# EAGLE design bGeigieNanoKit (EAGLE 6.4)
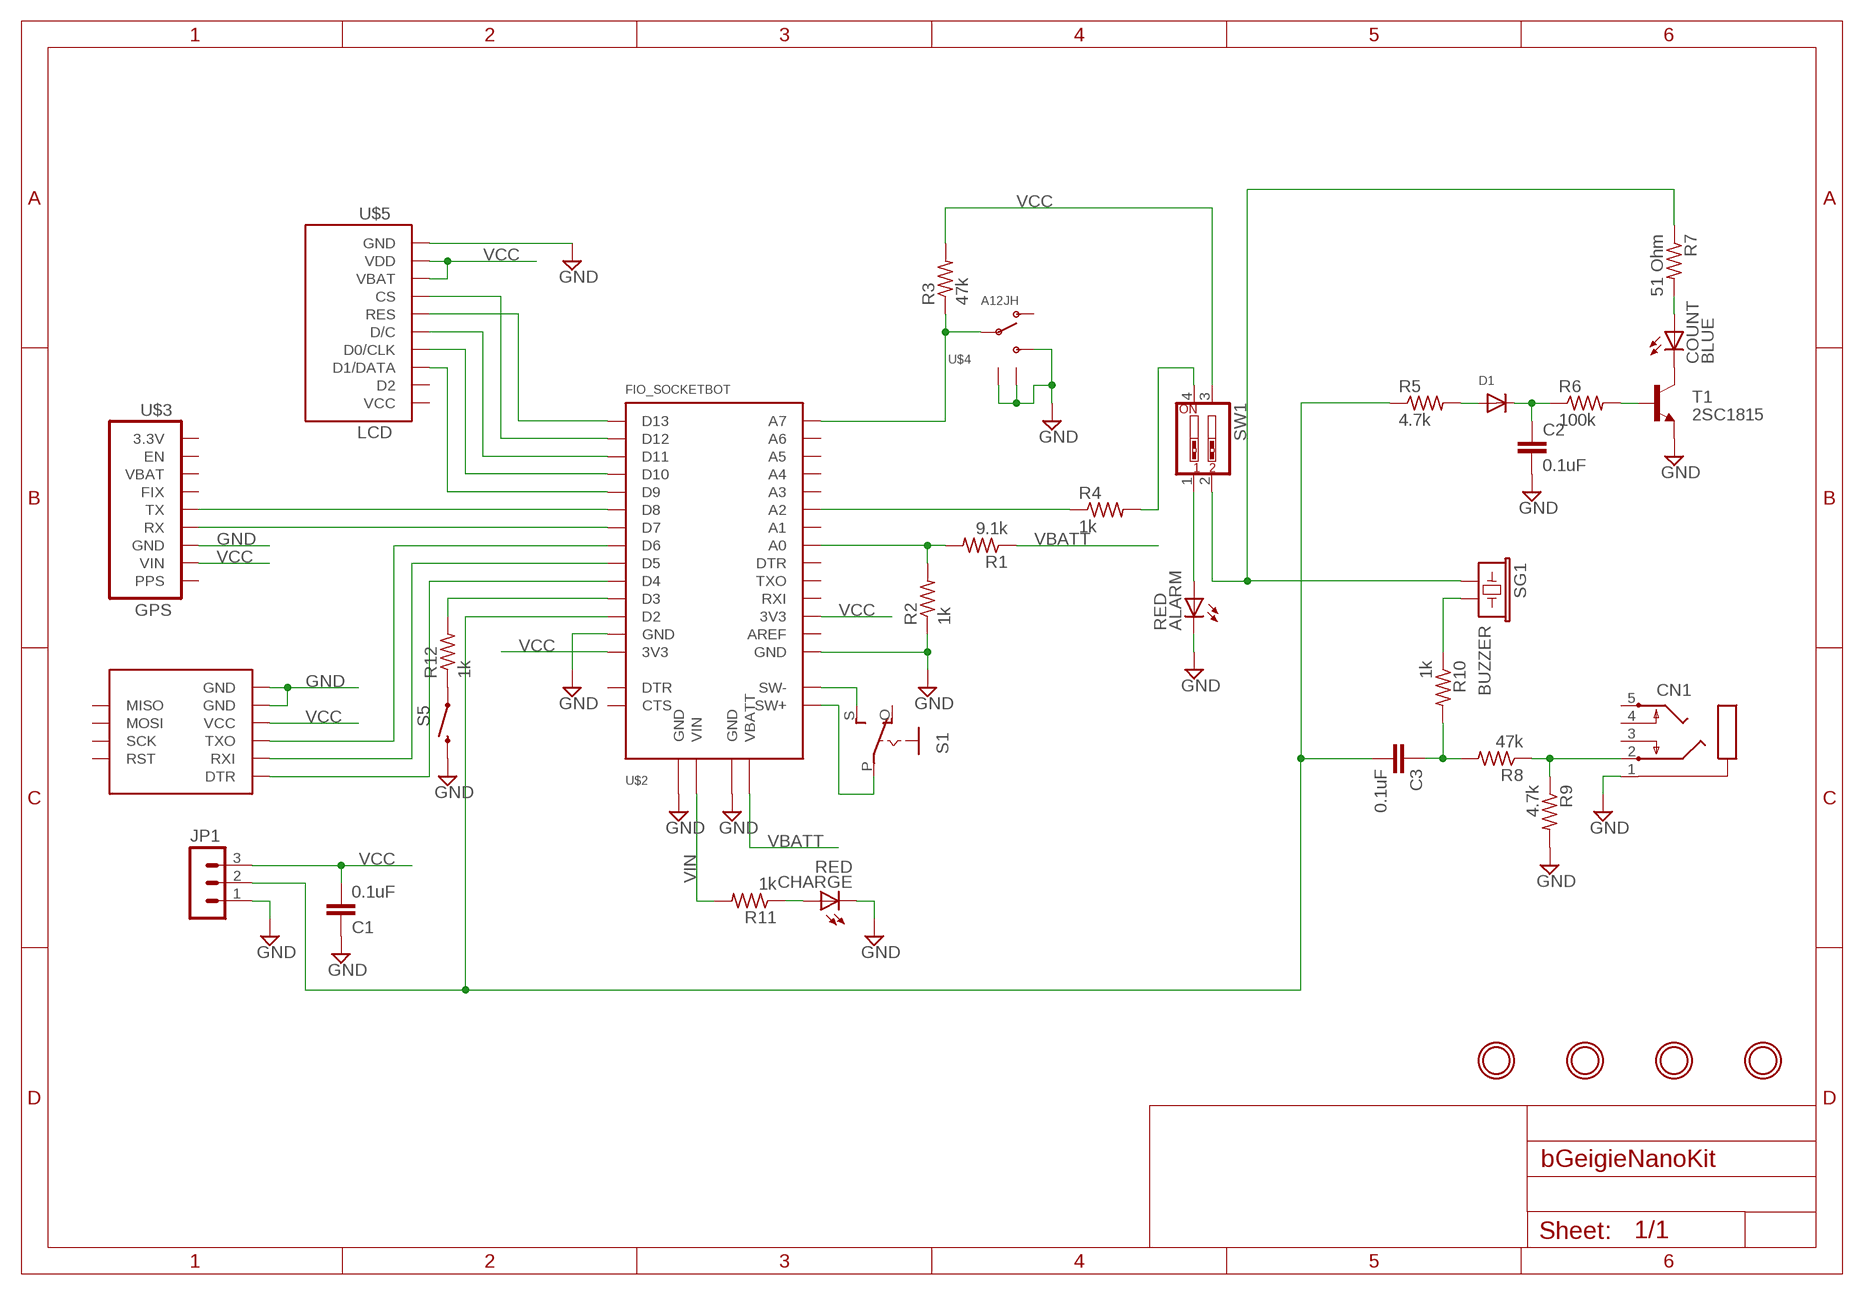
[diagram p0: schematic, sheet 1]

## Parts
ALARM  RED  LED3MM  [LED3MM]
C1  0.1uF  C-EU050-024X044  [C050-024X044]
C2  0.1uF  C-EU050-024X044  [C050-024X044]
C3  0.1uF  C-EU050-024X044  [C050-024X044]
CHARGE  RED  LED3MM  [LED3MM]
CN1  AUDIO_STEREOJACK  [STX3100]
COUNT  BLUE  LED3MM  [LED3MM]
D1  DIODEDO-1N4148  [DO-1N4148]
JP1  MA03-1  [MA03-1]
R1  9.1k  R-US_0207/10  [0207/10]
R2  1k  R-US_0207/10  [0207/10]
R3  47k  R-US_0207/10  [0207/10]
R4  1k  R-US_0207/10  [0207/10]
R5  4.7k  R-US_0207/10  [0207/10]
R6  100k  R-US_0207/10  [0207/10]
R7  51 Ohm  R-US_0207/10  [0207/10]
R8  47k  R-US_0207/10  [0207/10]
R9  4.7k  R-US_0207/10  [0207/10]
R10  1k  R-US_0207/10  [0207/10]
R11  1k  R-US_0207/10  [0207/10]
R12  1k  R-US_0207/10  [0207/10]
S1  EG1218S  [EG1218]
S5  SWITCH-MOMENTARY-2PTH  [TACTILE-PTH]
SG1  BUZZER  BUZZERPTH  [BUZZER-12MM]
SW1  SW_DIP-2  [EDG-02]
T1  2SC1815  [TO92-ECB]
U$1  OPENLOG  [OPENLOG]
U$2  FIO_SOCKETBOT  [FIO_V23_SOCKET_BOT]
U$3  GPS  ULTIMATE_GPSTOP  [ULTIMATE_GPS_V3_TOP]
U$4  A12JH  [A12AH]
U$5  LCD  SSD1306_128X64_LCD_MIN  [SSD1306_128X64_LCD_MIN]
U$6  MOUNTINGHOLE3.0THIN  [MOUNTINGHOLE_3.0_PLATEDTHIN]
U$7  MOUNTINGHOLE3.0THIN  [MOUNTINGHOLE_3.0_PLATEDTHIN]
U$8  MOUNTINGHOLE3.0THIN  [MOUNTINGHOLE_3.0_PLATEDTHIN]
U$9  MOUNTINGHOLE3.0THIN  [MOUNTINGHOLE_3.0_PLATEDTHIN]

## Nets
GND [PWP]: ALARM.K(C) C1.1 C2.2 CHARGE.K(C) CN1.1 JP1.1 R2.1 R9.2 S5.3 T1.E U$1.JP1$5(GND) U$1.JP1$6(GND) U$2.JP1$2(GND) U$2.JP2$1(GND) U$2.JP5$1(GND) U$2.JP6$1(GND) U$3.JP1$3(GND) U$3.U$8$P$1(GND) U$3.U$9$P$1(GND) U$4.P$3 U$4.P$4(GND) U$4.P$5(GND) U$5.P0\$10(GND)
N$1: U$2.JP1$10(D9) U$5.P0\$3(D1/DATA)
N$2: U$2.JP1$11(D10) U$5.P0\$4(D0/CLK)
N$3: U$2.JP1$12(D11) U$5.P0\$5(D/C)
N$4: U$2.JP1$13(D12) U$5.P0\$7(CS)
N$5: U$2.JP1$14(D13) U$5.P0\$6(RES)
N$6: U$2.JP1$9(D8) U$3.JP1$5(TX)
N$7: U$2.JP1$8(D7) U$3.JP1$4(RX)
N$8: U$1.JP1$3(TXO) U$2.JP1$7(D6)
N$9: U$1.JP1$2(RXI) U$2.JP1$6(D5)
N$10: U$1.JP1$1(DTR) U$2.JP1$5(D4)
N$11: R1.2 R2.2 U$2.JP5$7(A0)
N$12 [HIGH_PWR]: S1.P U$2.JP7$2(SW+)
N$13 [HIGH_PWR]: S1.S U$2.JP7$1(SW-)
N$14: R3.1 U$2.JP5$14(A7) U$4.P$2
N$15: R4.1 U$2.JP5$9(A2)
N$16: ALARM.A SW1.1
N$17: R4.2 SW1.4
N$18: C3.2 JP1.2 R5.1 U$2.JP1$3(D2)
N$19: COUNT.A R7.2
N$20: R12.1 S5.1
N$21: R7.1 SG1.+ SW1.2
N$22: COUNT.K(C) T1.C
N$23: R10.1 SG1.-
N$24: C3.1 R8.2 R10.2
N$25: CN1.2 R8.1 R9.1
N$26: D1.A R5.2
N$27: C2.1 D1.C R6.1
N$28: R6.2 T1.B
N$29: CHARGE.A R11.1
N$30: R12.2 U$2.JP1$4(D3)
VBATT: R1.1 U$2.JP2$2(VBATT)
VCC [PWP]: C1.2 JP1.3 R3.2 SW1.3 U$1.JP1$4(VCC) U$2.JP1$1(3V3) U$2.JP5$3(3V3) U$3.JP1$2(VIN) U$5.P0\$8(VBAT) U$5.P0\$9(VDD)
VIN: R11.2 U$2.JP6$2(VIN)
Unconnected: CN1.3 CN1.4 CN1.5 S1.O U$1.JP2$1(RST) U$1.JP2$2(SCK) U$1.JP2$3(MOSI) U$1.JP2$4(MISO) U$2.JP5$2(AREF) U$2.JP5$4(RXI) U$2.JP5$5(TXO) U$2.JP5$6(DTR) U$2.JP5$8(A1) U$2.JP5$10(A3) U$2.JP5$11(A4) U$2.JP5$12(A5) U$2.JP5$13(A6) U$2.JP8$1(CTS) U$2.JP9$1(DTR) U$3.JP1$1(PPS) U$3.JP1$6(FIX) U$3.JP1$8(EN) U$3.JP1$9(3.3V) U$4.P$1 U$5.P0\$2(D2)

## Power pins joined to a net without a drawn wire
VBAT: U$3.JP1$7(VBAT)
VCC: U$5.P0\$1(VCC)

## Library data of the parts
ALARM CHARGE COUNT = adafruit:LED: LED OSRAM: - CHIPLED LG R971, LG N971, LY N971, LG Q971, LY Q971, LO R971, LY R971 LH N974, LH R974 LS Q976, LO Q976, LY Q976 LO Q996 - Hyper CHIPLED LW Q18S LB Q993, LB Q99A, LB R99A - SideLED LS A670, LO A670, LY A670, LG A670, LP A670 LB A673, LV A673, LT A673, LW A673 LH A674 LY A675 LS A676, LA A676, LO A676, LY A676, LW A676 LS A679, LY A679, LG A679 - Hyper Micro SIDELED® LS Y876, LA Y876, LO Y876, LY Y876 LT Y87S - SmartLED LW L88C, LW L88S LB L89C, LB L89S, LG L890 LS L89K, LO L89K, LY L89K LS L896, LA L896, LO L896, LY L896 - TOPLED LS T670, LO T670, LY T670, LG T670, LP T670 LSG T670, LSP T670, LSY T670, LOP T670, LYG T670 LG T671, LOG T671, LSG T671 LB T673, LV T673, LT T673, LW T673 LH T674 LS T676, LA T676, LO T676, LY T676, LB T676, LH T676, LSB T676, LW T676 LB T67C, LV T67C, LT T67C, LS T67K, LO T67K, LY T67K, LW E67C LS E67B, LA E67B, LO E67B, LY E67B, LB E67C, LV E67C, LT E67C LW T67C LS T679, LY T679, LG T679 LS T770, LO T770, LY T770, LG T770, LP T770 LB T773, LV T773, LT T773, LW T773 LH T774 LS E675, LA E675, LY E675, LS T675 LS T776, LA T776, LO T776, LY T776, LB T776 LHGB T686 LT T68C, LB T68C - Hyper Mini TOPLED® LB M676 - Mini TOPLED Santana® LG M470 LS M47K, LO M47K, LY M47K Source: http://www.osram.convergy.de/
C1-C3 = rcl:C-EU: CAPACITOR, European symbol
CN1 = microbuilder:AUDIO_STEREOJACK: MIC/HEADPHONE JACK Stereo jack with two switches. Kycon STX3100, CUI SJ1-3555NG and/or 4UCon 05544 Digikey: CP1-3555NG-ND Shamelessly taken from the Adafruit Eagle library (public domain) ... thanks! These are normally connected as follows, from right-to-left on the schematic symbol above: Tip: Left Audio Inner Ring: Right Audio Shell: Common/GND
D1 = adafruit:DIODE: Diode SMADIODE - SMA Surface Mount Package 20V 1A Schottky Diode Digikey: 641-1014-6-ND DO-1N4148 - Through Hole Small Current Diode SOD-123 20V 1 A (.5mV Vf) Schottky Diode - Digikey: MBRX120TPMSCT-ND SOD-323 10V 570mA (.38mV Vf, 3ns) Schottky Diode - Digikey: ZLLS410CT-ND SOD-523 30V 30mA Schottky Diode (RB751S-40TE61) - Digikey: RB751S-40TE61CT-ND SOT23-R/W - SOT23 Package (R = Solder Paste/Reflow Ovens, W = Hand-Soldering) BAT54Film 40V 300mA - Digikey: 497-7162-1-ND
JP1 = con-lstb:MA03-1: PIN HEADER; OC_FARNELL: unknown; OC_NEWARK: unknown
R1-R12 = rcl:R-US_: RESISTOR, American symbol
S1 = adafruit:EG1218: SLIDING SWITCH 0.1" spacing through hole, vertical SPDT slide switch http://www.ladyada.net/library/pcb/eaglelibrary.html
S5 = SparkFun:SWITCH-MOMENTARY-2
SG1 = SparkFun:BUZZER: Buzzer 12mm Spark Fun Electronics SKU : Comp-Buzzer
SW1 = special:SW_DIP-2: DIP SWITCH
T1 = transistor:2SC1815: NPN EPITAXIAL TRANSISTOR Source: TOSHIBA .. 2SC1815 1.pdf
U$1 = open_hw_sockets:OPENLOG
U$2 = open_hw_sockets:FIO_SOCKET
U$3 = open_hw_sockets:ULTIMATE_GPS
U$4 = open_hw_sockets:A12JH
U$5 = open_hw_sockets:SSD1306_128X64_LCD_MIN
U$6-U$9 = microbuilder:MOUNTINGHOLE: Mounting Hole For #2 screws (0.086"/2.18mm width, 0.094"/2.4mm hole) use 2.5mm

## Net classes
0 default: width 0.406 mm, drill 0.254 mm, clearance 0.305 mm
1 PWP: width 0.813 mm, drill 0.254 mm, clearance 0.305 mm
2 HIGH_PWR: width 1.422 mm, drill 0.508 mm, clearance 0.406 mm

## Board
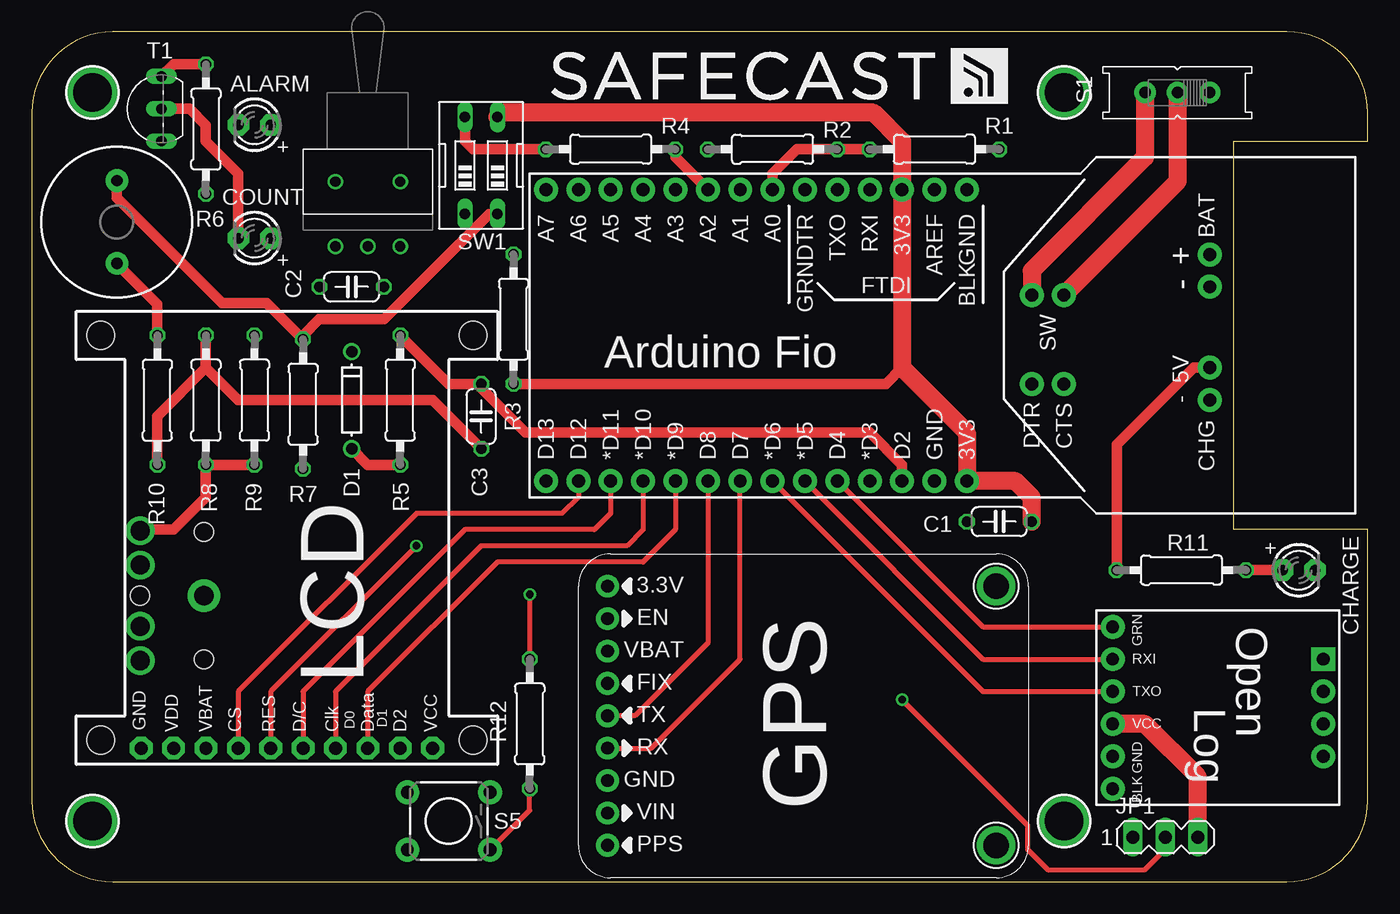
[diagram p1: board, top side]
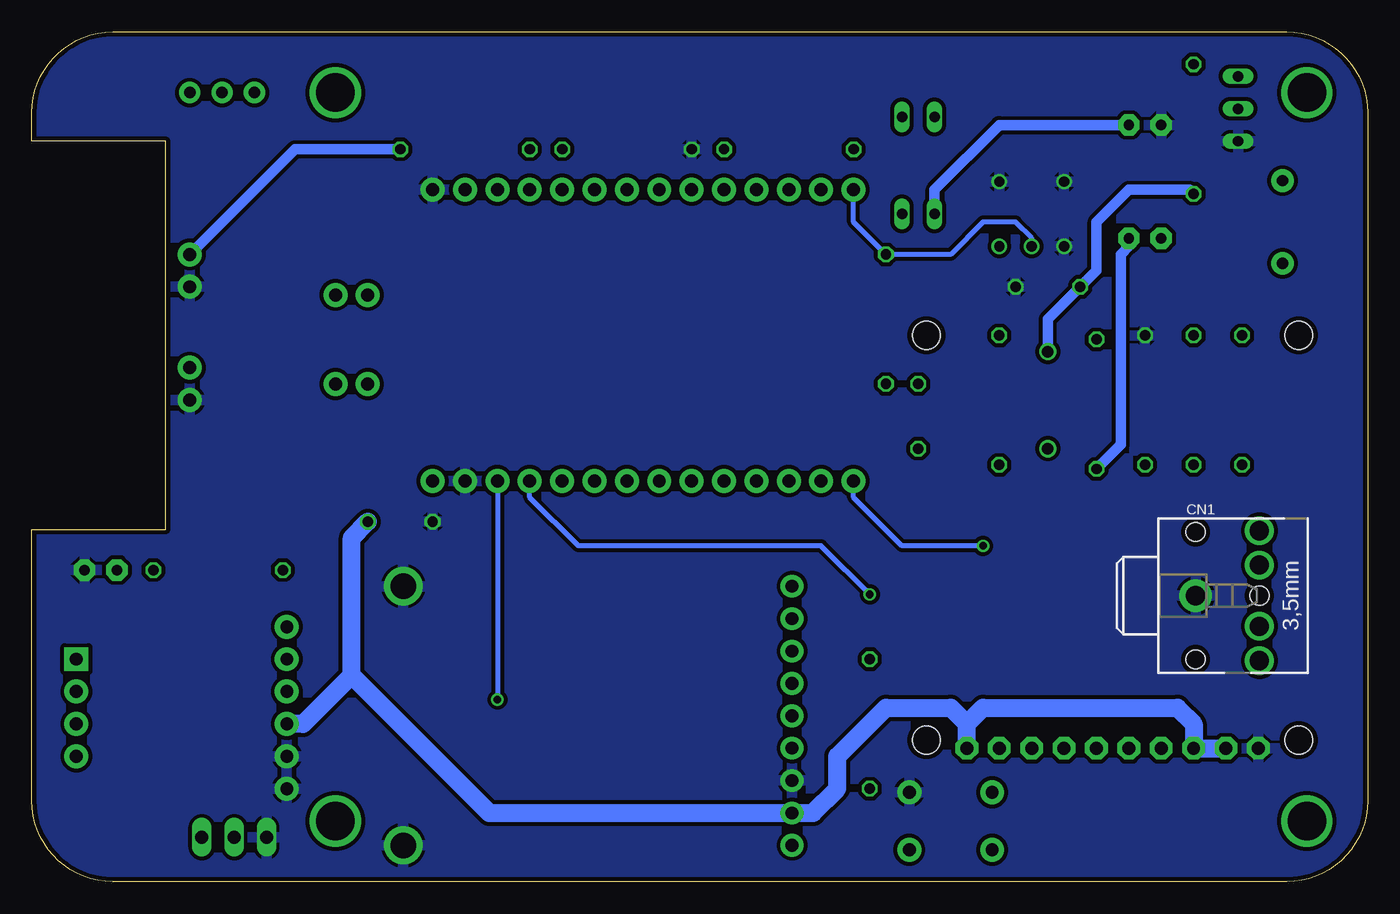
[diagram p2: board, bottom side, seen from below]

Size 104.77 x 66.67 mm. Coordinates in mm from the lower left corner, seen from the top.
Outline: 0,60.33 0,6.35 arc90 6.35,0 98.43,0 arc90 104.77,6.35 104.77,27.62 94.3,27.62 94.3,58.1 104.77,58.1 104.77,60.33 arc90 98.43,66.68 6.35,66.68 arc90 0,60.33
Copper layers (1*16): Top 0.0356mm / dielectric 1.5011mm / Bottom 0.0356mm
Design rules "LaenPCBOrder": minimum track width 6mil, minimum drill 13mil, track to track 6mil, track to pad 6mil, pad to pad 6mil, via to via 6mil, smd to smd 6mil, copper to edge 15mil, drill to drill 6mil, minimum pad ring 7mil, minimum via ring 7mil, stop-mask expansion 4mil, vias tented up to drill 0mil, thermal gap 10mil

### Footprints (pad centres in the part's own frame; a part is rotated, then mirrored left to right if it is on the bottom)
LED3MM = drill 0.813 pad 1.676 octagon: A -1.27,0; K 1.27,0
C050-024X044 = drill 0.813 octagon: 1 -2.54,0; 2 2.54,0
STX3100 = drill 1.5 pad 2.54: 1 2.7,-0.1 | drill 1.5: 2 7.7,5; 3 7.7,2.3; 4 7.7,-2.5; 5 7.7,-5.2 | hole 1.5: 2.7,4.9; 2.7,-5.1; 7.7,-0.1
DO-1N4148 = drill 0.9: A -3.81,0; C 3.81,0
MA03-1 = drill 1.016 long: 1 -2.54,0; 2 0,0; 3 2.54,0
0207/10 = drill 0.813 octagon: 1 -5.08,0; 2 5.08,0
EG1218 = drill 0.9 pad 1.676: O -2.54,0; P 0,0; S 2.54,0
TACTILE-PTH = drill 1.016 pad 1.88: 1 -3.251,2.261; 2 3.251,2.261; 3 -3.251,-2.261; 4 3.251,-2.261
BUZZER-12MM = drill 0.9 pad 1.778: + 3.25,0; - -3.25,0
EDG-02 = drill 0.813 long: 1 -1.27,-3.81; 2 1.27,-3.81; 3 1.27,3.81; 4 -1.27,3.81
TO92-ECB = drill 0.813 long: B 2.54,0; C 0,0; E -2.54,0
OPENLOG = drill 1.016 pad 1.88: JP1$1 1.27,1.27; JP1$2 3.81,1.27; JP1$3 6.35,1.27; JP1$4 8.89,1.27; JP1$5 11.43,1.27; JP1$6 13.97,1.27; JP2$2 6.35,17.78; JP2$3 8.89,17.78; JP2$4 11.43,17.78 | drill 1.016 pad 1.88 square: JP2$1 3.81,17.78
FIO_V23_SOCKET_BOT = drill 1.016 pad 1.88: JP1$1 1.27,34.29; JP1$2 1.27,31.75; JP1$3 1.27,29.21; JP1$4 1.27,26.67; JP1$5 1.27,24.13; JP1$6 1.27,21.59; JP1$7 1.27,19.05; JP1$8 1.27,16.51; JP1$9 1.27,13.97; JP1$10 1.27,11.43; JP1$11 1.27,8.89; JP1$12 1.27,6.35; JP1$13 1.27,3.81; JP1$14 1.27,1.27; JP2$1 16.51,53.34; JP2$2 19.05,53.34; JP5$1 24.13,34.29; JP5$2 24.13,31.75; JP5$3 24.13,29.21; JP5$4 24.13,26.67; JP5$5 24.13,24.13; JP5$6 24.13,21.59; JP5$7 24.13,19.05; JP5$8 24.13,16.51; JP5$9 24.13,13.97; JP5$10 24.13,11.43; JP5$11 24.13,8.89; JP5$12 24.13,6.35; JP5$13 24.13,3.81; JP5$14 24.13,1.27; JP6$1 7.62,53.34; JP6$2 10.16,53.34; JP7$1 15.875,39.37; JP7$2 15.875,41.91; JP8$1 8.89,41.91; JP9$1 8.89,39.37
ULTIMATE_GPS_V3_TOP = drill 1 pad 1.778: JP1$1 22.86,2.286; JP1$2 20.32,2.286; JP1$3 17.78,2.286; JP1$4 15.24,2.286; JP1$5 12.7,2.286; JP1$6 10.16,2.286; JP1$7 7.62,2.286; JP1$8 5.08,2.286; JP1$9 2.54,2.286 | drill 2 pad 3: U$8$P$1 2.54,32.782; U$9$P$1 22.86,32.782
A12AH = drill 0.8: P$1 -2.54,5.08; P$2 0,5.08; P$3 2.54,5.08; P$4 -2.54,0; P$5 2.54,0
SSD1306_128X64_LCD_MIN = drill 1.016 pad 1.778 octagon: P0\$1 1.27,1.27; P0\$2 1.27,3.81; P0\$3 1.27,6.35; P0\$4 1.27,8.89; P0\$5 1.27,11.43; P0\$6 1.27,13.97; P0\$7 1.27,16.51; P0\$8 1.27,19.05; P0\$9 1.27,21.59; P0\$10 1.27,24.13 | hole 2.2: 33.655,-1.905; 1.905,-1.905; 33.655,27.305; 1.905,27.305
MOUNTINGHOLE_3.0_PLATEDTHIN = drill 3 pad 3.6: P$1 0,0

### Placement (x,y rotation side)
ALARM  17.46,59.37 180 top
C1  75.88,28.26 0 top
C2  25.08,46.67 0 top
C3  35.24,36.51 90 top
CHARGE  99.38,24.45 0 top
CN1  16.19,22.54 0 bottom
COUNT  17.46,50.48 180 top
D1  25.08,37.78 90 top
JP1  88.9,3.49 0 top
R1  70.8,57.47 180 top
R2  58.1,57.47 0 top
R3  37.78,44.13 270 top
R4  45.4,57.47 180 top
R5  28.89,37.78 270 top
R6  13.65,59.05 90 top
R7  21.27,37.47 270 top
R8  13.65,37.78 90 top
R9  17.46,37.78 90 top
R10  9.84,37.78 270 top
R11  90.17,24.45 180 top
R12  39.05,12.38 90 top
S1  89.85,61.91 180 top
S5  32.7,4.76 180 top
SG1  6.67,51.75 90 top
SW1  35.24,56.2 0 top
T1  10.16,60.64 90 top
U$1  83.5,21.27 270 top
U$2  39.05,30.16 90 bottom
U$3  42.86,25.72 270 top
U$4  26.35,54.93 180 top
U$5  32.7,9.21 90 top
U$6  80.96,61.91 0 top
U$7  80.96,4.76 0 top
U$8  4.76,4.76 0 top
U$9  4.76,61.91 0 top
U$10  [SAFECAST_LOGO1]  40.32,60.64 0 top

### Tracks (layer width: path | path; a pad name or v marks a point on that pad's centre or on a via)
GND
  pour Bottom (isolate 0.305): -1.59,-1.59 106.36,-1.59 106.36,68.26 -1.59,68.26
N$1
  Top 0.406: U$2.JP1$10 50.48,27.62 47.94,25.08 36.51,25.08 26.35,14.92 U$5.P0\$3
N$2
  Top 0.406: U$2.JP1$11 47.94,27.62 46.67,26.35 35.24,26.35 23.81,14.92 U$5.P0\$4
N$3
  Top 0.406: U$2.JP1$12 45.4,28.89 44.13,27.62 33.97,27.62 21.27,14.92 U$5.P0\$5
N$4
  Top 0.406: U$2.JP1$13 42.86,30.16 41.59,28.89 30.16,28.89 16.19,14.92 U$5.P0\$7
N$5  (via drill 0.6)
  Top 0.406: v30.16,26.35 18.73,14.92 U$5.P0\$6
  Bottom 0.406: v30.16,26.35 36.51,26.35 40.32,30.16 U$2.JP1$14
N$6
  Top 0.406: U$2.JP1$9 53.02,18.73 47.31,13.02 U$3.JP1$5
N$7
  Top 0.406: U$3.JP1$4 48.58,10.48 55.56,17.46 U$2.JP1$8
N$8
  Top 0.406: U$2.JP1$7 74.61,14.92 U$1.JP1$3
N$9
  Top 0.406: U$2.JP1$6 74.61,17.46 U$1.JP1$2
N$10
  Top 0.406: U$2.JP1$5 74.61,20 U$1.JP1$1
N$11
  Top 0.813: U$2.JP5$7 58.1,55.56 60.01,57.47 R2.2 R1.2
N$12
  Top 1.422: S1.P 89.85,54.93 U$2.JP7$2
N$13
  Top 1.422: S1.S 87.31,56.83 78.42,47.94 U$2.JP7$1
N$14
  Bottom 0.406: U$4.P$2 26.35,50.48 27.62,51.75 30.16,51.75 32.7,49.21 R3.1 40.32,51.75 U$2.JP5$14
N$15
  Top 0.813: R4.1 50.48,56.83 U$2.JP5$9
N$16
  Bottom 0.813: SW1.1 33.97,54.29 28.89,59.37 ALARM.A
N$17
  Top 0.813: R4.2 34.61,57.47 33.97,58.1 SW1.4
N$18  (via drill 0.6)
  Top 0.406: v68.26,14.29 78.1,4.44 78.1,2.54 79.69,0.95 87.31,0.95 88.9,2.54 JP1.2
  Top 0.813: U$2.JP1$3 68.26,32.7 65.72,35.24 38.73,35.24 35.24,38.73 C3.2 32.7,39.05 R5.1
  Bottom 0.406: U$2.JP1$3 v68.26,14.29
N$19
  Bottom 0.813: R7.2 19.37,34.29 19.37,49.21 18.73,49.85 COUNT.A
N$20
  Top 0.406: S5.1 39.05,5.6 R12.1
N$21
  Top 0.813: SG1.+ 6.67,53.66 14.92,45.4 18.42,45.4 R7.1 21.27,42.86 22.54,44.13 27.62,44.13 35.88,52.39 SW1.2
N$22
  Top 0.813: COUNT.K 16.19,55.56 13.65,58.1 13.65,59.37 12.38,60.64 T1.C
N$23
  Top 0.813: SG1.- 9.84,45.33 R10.1
N$24
  Top 0.813: R8.2 13.65,40.32 | 13.65,40.32 9.84,36.51 R10.2 | C3.1 31.43,37.78 16.19,37.78 13.65,40.32
N$25
  Top 0.813: CN1.2 8.57,27.62 11.11,27.62 13.65,30.16 R8.1 R9.1
N$26
  Top 0.813: R5.2 26.35,32.7 D1.A
N$27
  Bottom 0.813: D1.C 25.08,44.13 C2.1 21.27,47.94 21.27,51.75 18.73,54.29 13.97,54.29 R6.1
N$28
  Top 0.813: T1.B 11.11,64.13 R6.2
N$29
  Top 0.813: R11.1 CHARGE.A
N$30  (via drill 0.6)
  Top 0.406: v39.05,22.54 R12.2
  Bottom 0.406: v39.05,22.54 42.86,26.35 61.91,26.35 65.72,30.16 U$2.JP1$4
VBATT
  Bottom 0.813: U$2.JP2$2 84.14,57.47 R1.1
VCC
  Top 0.813: R3.2 66.99,39.05 68.26,40.32
  Top 1.422: C1.2 78.42,30.16 77.15,31.43 U$2.JP1$1 73.34,35.24 68.26,40.32 U$2.JP5$3 68.26,58.1 66.04,60.33 36.83,60.33 SW1.3 | JP1.3 91.44,8.25 87.31,12.38 U$1.JP1$4
  Bottom 1.422: 79.69,16.19 79.69,26.99 C1.2 | U$1.JP1$4 83.5,12.38 79.69,16.19 | 79.69,16.19 68.9,5.4 U$3.JP1$2 43.5,5.4 41.59,7.3 41.59,9.84 37.78,13.65 32.7,13.65 31.43,12.38 | U$5.P0\$1 31.43,12.38 | 31.43,12.38 30.16,13.65 14.92,13.65 13.65,12.38 U$5.P0\$8 U$5.P0\$9
VIN
  Top 0.813: R11.2 85.09,34.29 91.12,40.32 U$2.JP6$2